# EAGLE design Filter (EAGLE 6.5.0)
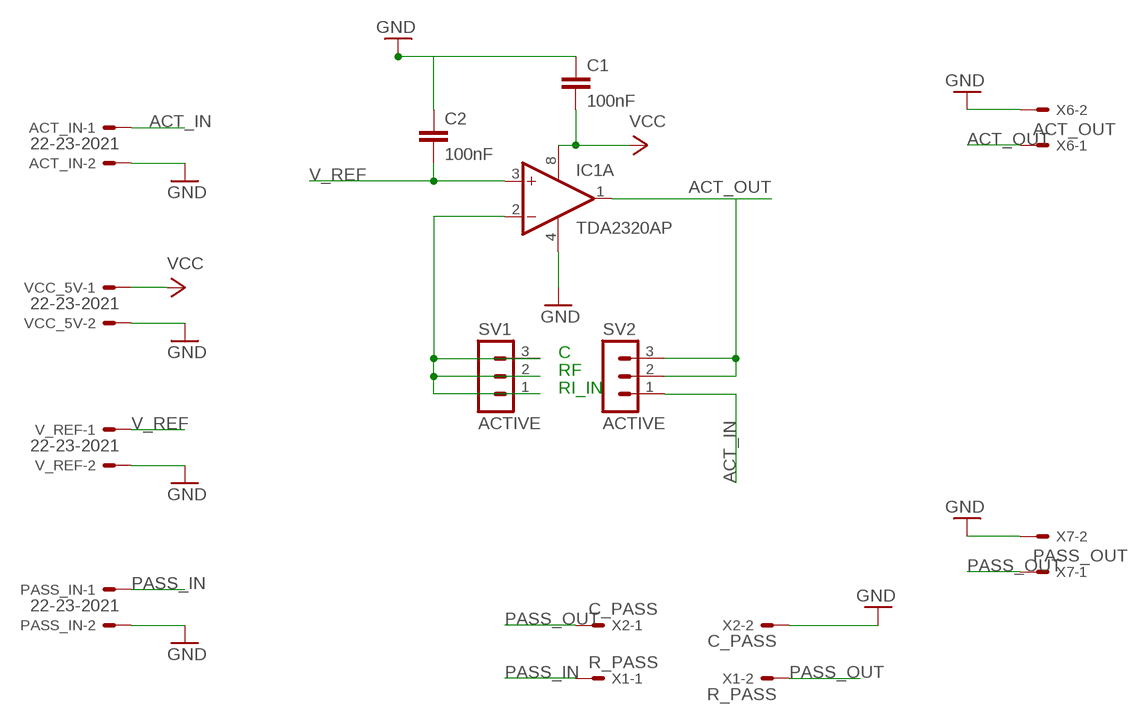
[diagram p0: schematic, sheet 1]

## Parts
ACT_IN  22-23-2021  [22-23-2021]
C1  100nF  C5/3  [C5B3]
C2  100nF  C5/3  [C5B3]
IC1  TDA2320AP  [DIL08]
PASS_IN  22-23-2021  [22-23-2021]
SV1  ACTIVE  MA03-1  [MA03-1]
SV2  ACTIVE  MA03-1  [MA03-1]
V_REF  22-23-2021  [22-23-2021]
VCC_5V  22-23-2021  [22-23-2021]
X1  R_PASS  87758-0216  [87758-0216]
X2  C_PASS  87758-0216  [87758-0216]
X6  ACT_OUT  22-23-2021  [22-23-2021]
X7  PASS_OUT  22-23-2021  [22-23-2021]

## Nets
ACT_IN: ACT_IN.1 SV2.1
ACT_OUT: IC1.1(A:OUT) SV2.2 SV2.3 X6.1
GND: ACT_IN.2 C1.1 C2.1 IC1.4(P:V-) PASS_IN.2 V_REF.2 VCC_5V.2 X2.2 X6.2 X7.2
N$2: IC1.2(A:-IN) SV1.1 SV1.2 SV1.3
PASS_IN: PASS_IN.1 X1.1
PASS_OUT: X1.2 X2.1 X7.1
V_REF: C2.2 IC1.3(A:+IN) V_REF.1
VCC: C1.2 IC1.8(P:V+) VCC_5V.1
Unconnected: IC1.5(B:+IN) IC1.6(B:-IN) IC1.7(B:OUT)

## Notes on the sheet
- C
- RF
- RI_IN

## Library data of the parts
ACT_IN PASS_IN V_REF VCC_5V X6 X7 = con-molex:22-23-2021: .100" (2.54mm) Center Header - 2 Pin; MF: MOLEX; MPN: 22-23-2021; OC_FARNELL: 1462926; OC_NEWARK: 25C3832
C1 C2 = capacitor-wima:C: CAPACITOR naming: grid - package width
IC1 = linear:TDA2320A: Power OP AMP
SV1 SV2 = con-lstb:MA03-1: PIN HEADER; OC_FARNELL: unknown; OC_NEWARK: unknown
X1 X2 = con-molex:87758-0216: 2 Pin - 2mm Dual Row Single Wafer, Vertical T/H HDR Source: http://www.molex.com/pdm_docs/sd/877580616_sd.pdf; MPN: 87758-0216; OC_FARNELL: unknown; OC_NEWARK: 94M1513

## Board
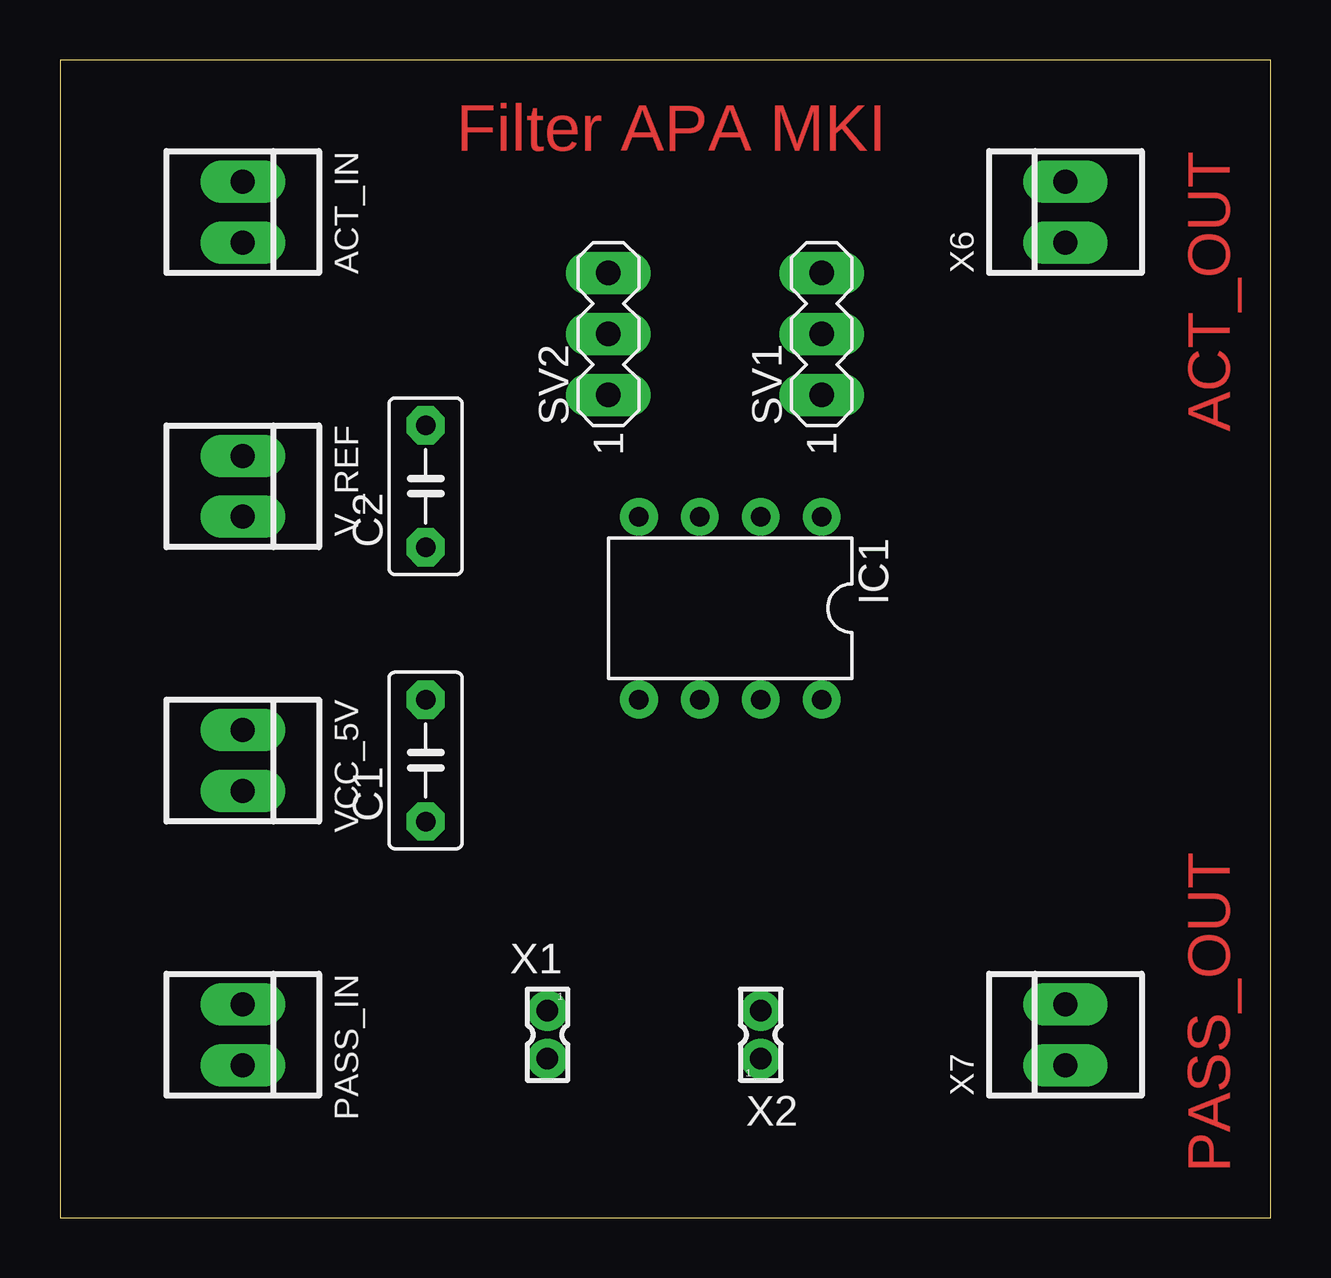
[diagram p1: board, top side]
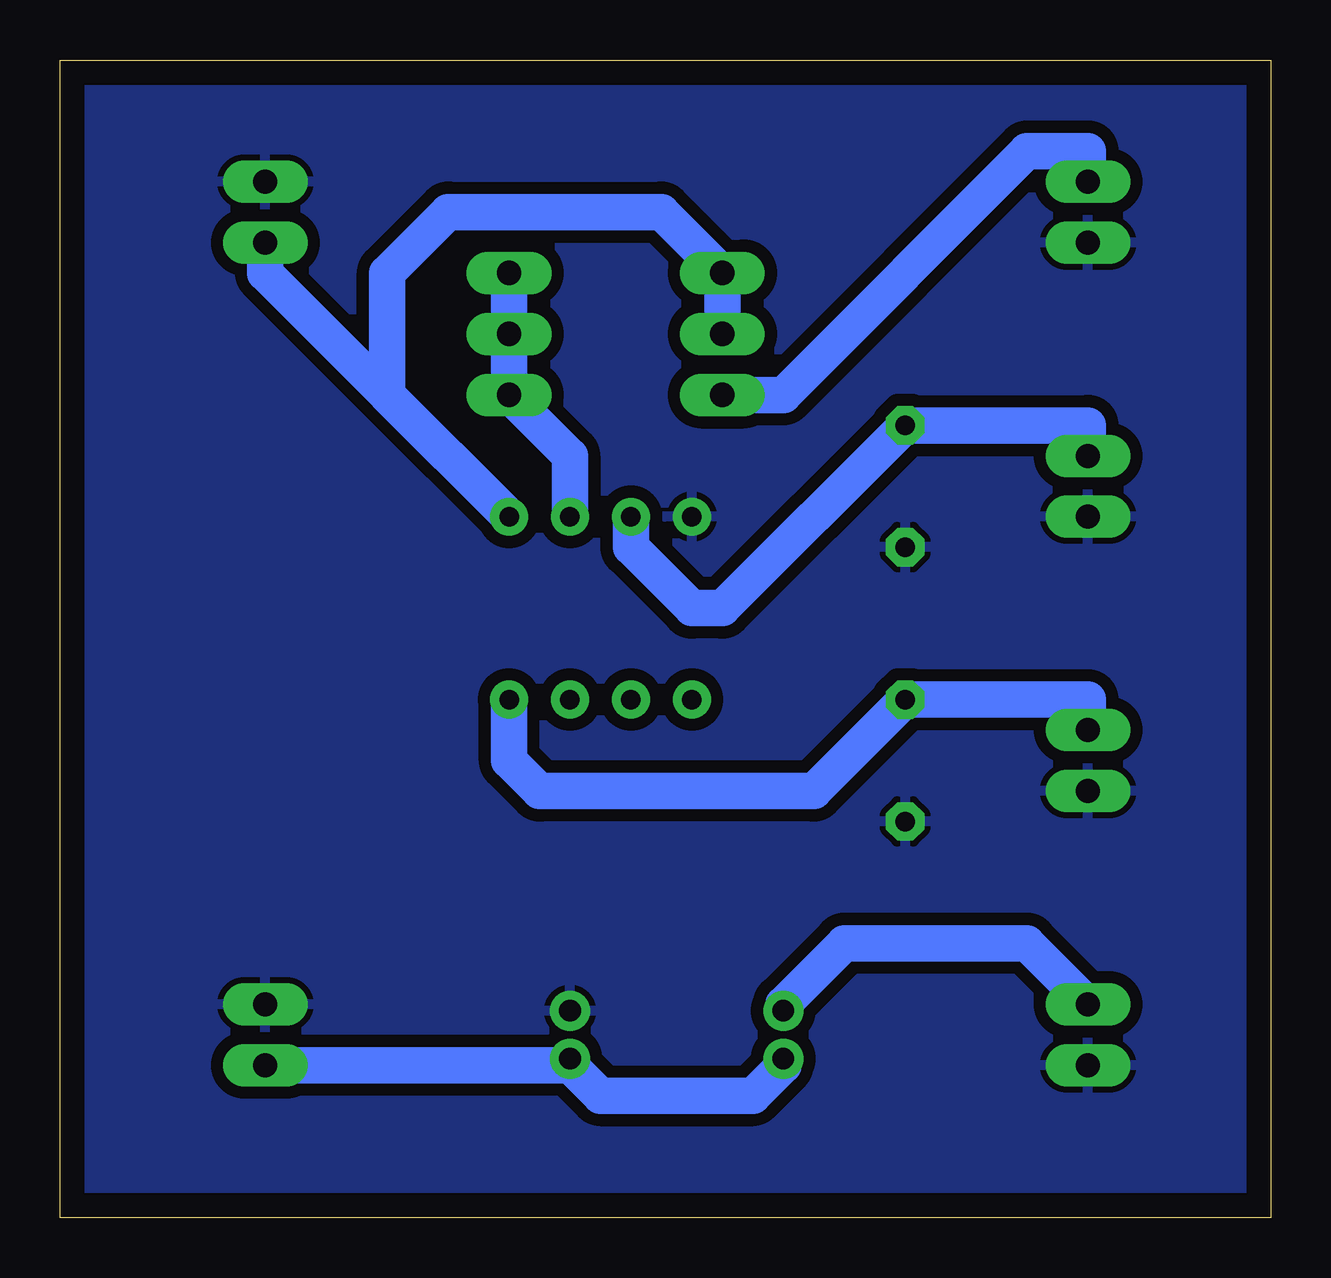
[diagram p2: board, bottom side, seen from below]

Size 50.47 x 48.25 mm. Coordinates in mm from the lower left corner, seen from the top.
Outline: 0,0 50.47,0 50.47,48.25 0,48.25 0,0
Copper layers (1*16): Top 0.035mm / dielectric 1.5mm / Bottom 0.035mm
Design rules "default *": minimum track width 60mil, minimum drill 24mil, track to track 20mil, track to pad 20mil, pad to pad 20mil, via to via 20mil, smd to smd 8mil, copper to edge 40mil, drill to drill 8mil, minimum pad ring 15mil, minimum via ring 8mil, stop-mask expansion 4mil, vias tented up to drill 0mil, thermal gap 10mil

### Footprints (pad centres in the part's own frame; a part is rotated, then mirrored left to right if it is on the bottom)
22-23-2021 = drill 1 long: 1 -1.27,0; 2 1.27,0
C5B3 = drill 0.813 pad 1.6 octagon: 1 -2.54,0; 2 2.54,0
DIL08 = drill 0.813 pad 1.27: 1 -3.81,-3.81; 2 -1.27,-3.81; 3 1.27,-3.81; 4 3.81,-3.81; 5 3.81,3.81; 6 1.27,3.81; 7 -1.27,3.81; 8 -3.81,3.81
MA03-1 = drill 1.016 long: 1 -2.54,0; 2 0,0; 3 2.54,0
87758-0216 = drill 0.9 pad 1.27: 1 0,-1; 2 0,1

### Placement (x,y rotation side)
ACT_IN  7.62,41.91 270 top
C1  15.24,19.05 90 top
C2  15.24,30.48 90 top
IC1  27.94,25.4 180 top
PASS_IN  7.62,7.62 270 top
SV1  31.75,36.83 90 top
SV2  22.86,36.83 90 top
V_REF  7.62,30.48 270 top
VCC_5V  7.62,19.05 270 top
X1  20.32,7.62 180 top
X2  29.21,7.62 0 top
X6  41.91,41.91 90 top
X7  41.91,7.62 90 top

### Tracks (layer width: path | path; a pad name or v marks a point on that pad's centre or on a via)
ACT_IN
  Bottom 1.524: SV2.1 20.32,34.29 10.16,44.45 7.62,44.45 ACT_IN.1
ACT_OUT
  Bottom 1.524: SV2.2 SV2.3 25.4,41.91 34.29,41.91 36.83,39.37 36.83,34.29 | 36.83,34.29 41.91,39.37 X6.1 | 36.83,34.29 IC1.1
GND
  pour Bottom: 0,48.26 50.8,48.26 50.8,0 0,0
N$2
  Bottom 1.524: SV1.3 SV1.2 SV1.1 29.21,31.75 IC1.2
PASS_IN
  Bottom 1.524: PASS_IN.1 10.16,11.43 17.78,11.43 20.32,8.89 X1.1
PASS_OUT
  Bottom 1.524: 29.21,6.35 27.94,5.08 21.59,5.08 20.32,6.35 X1.2 | 29.21,6.35 X7.1 | 29.21,6.35 X2.1
V_REF
  Bottom 1.524: IC1.3 26.67,27.94 24.13,25.4 22.86,25.4 C2.2 7.62,33.02 V_REF.1
VCC
  Bottom 1.524: IC1.8 31.75,19.05 30.48,17.78 19.05,17.78 C1.2 7.62,21.59 VCC_5V.1

### Text on the board
Top: Filter APA MKI | ACT_OUT | PASS_OUT